# Altium schematic sheet LED-PCB_DIG1.SchDoc
size B; SheetNumber: 3; SheetTotal: 5
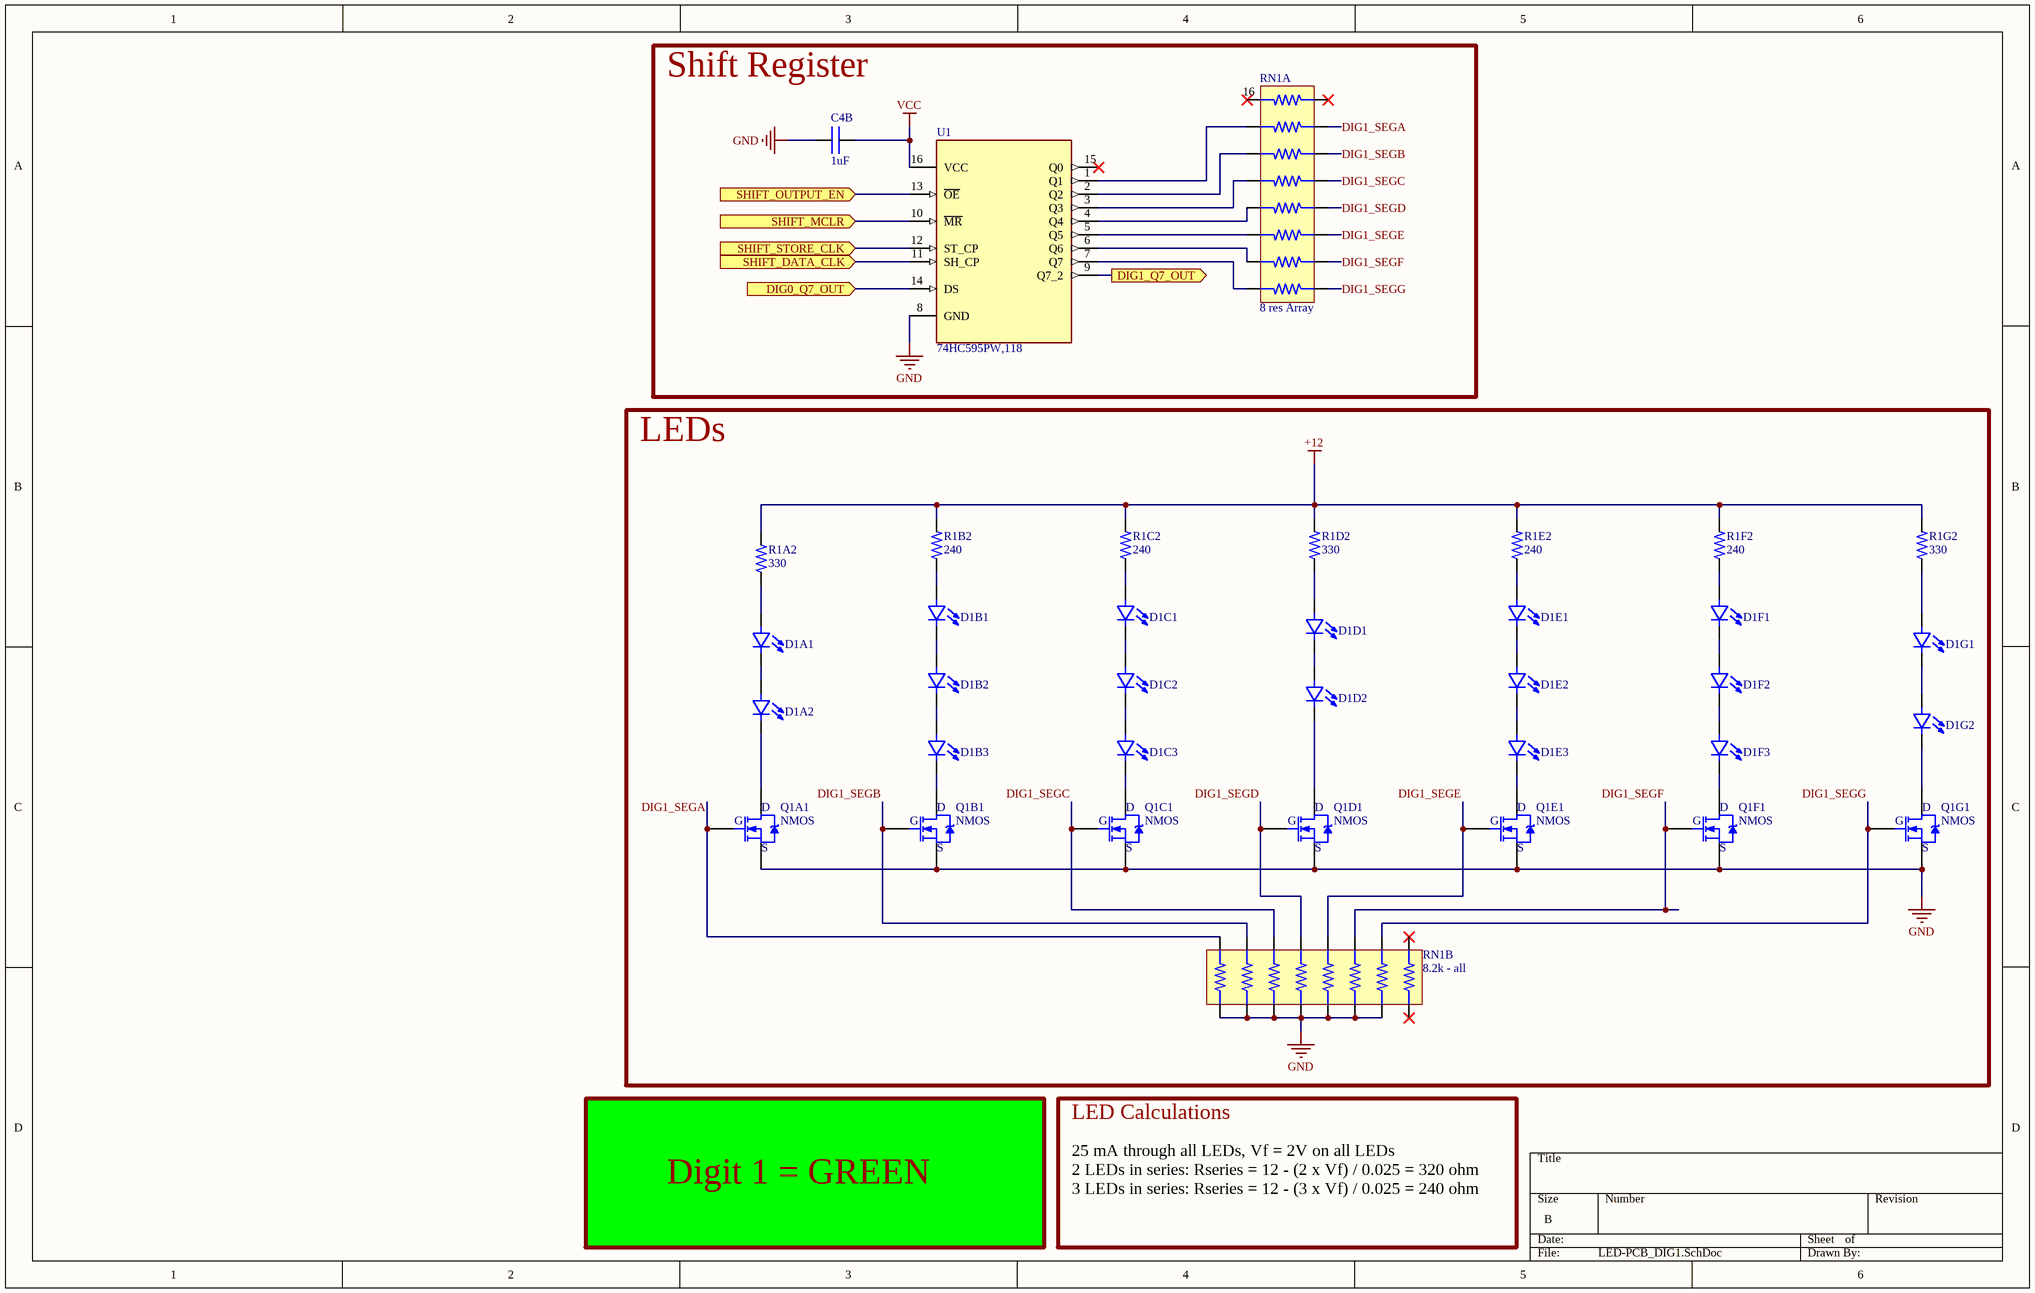
[diagram p0: LED-PCB_DIG1.SchDoc]

## Parts
C4B  value 1uF  [0402 CAP]  (hidden comment: CAP)
D1A1  LED - single  [LED - 0603]  (value not drawn)
D1A2  LED - single  [LED - 0603]  (value not drawn)
D1B1  LED - single  [LED - 0603]  (value not drawn)
D1B2  LED - single  [LED - 0603]  (value not drawn)
D1B3  LED - single  [LED - 0603]  (value not drawn)
D1C1  LED - single  [LED - 0603]  (value not drawn)
D1C2  LED - single  [LED - 0603]  (value not drawn)
D1C3  LED - single  [LED - 0603]  (value not drawn)
D1D1  LED - single  [LED - 0603]  (value not drawn)
D1D2  LED - single  [LED - 0603]  (value not drawn)
D1E1  LED - single  [LED - 0603]  (value not drawn)
D1E2  LED - single  [LED - 0603]  (value not drawn)
D1E3  LED - single  [LED - 0603]  (value not drawn)
D1F1  LED - single  [LED - 0603]  (value not drawn)
D1F2  LED - single  [LED - 0603]  (value not drawn)
D1F3  LED - single  [LED - 0603]  (value not drawn)
D1G1  LED - single  [LED - 0603]  (value not drawn)
D1G2  LED - single  [LED - 0603]  (value not drawn)
Q1A1  NMOS  [SOT-23]
Q1B1  NMOS  [SOT-23]
Q1C1  NMOS  [SOT-23]
Q1D1  NMOS  [SOT-23]
Q1E1  NMOS  [SOT-23]
Q1F1  NMOS  [SOT-23]
Q1G1  NMOS  [SOT-23]
R1A2  value 330  [0402 RES]  (hidden comment: RES)
R1B2  value 240  [0402 RES]  (hidden comment: RES)
R1C2  value 240  [0402 RES]  (hidden comment: RES)
R1D2  value 330  [0402 RES]  (hidden comment: RES)
R1E2  value 240  [0402 RES]  (hidden comment: RES)
R1F2  value 240  [0402 RES]  (hidden comment: RES)
R1G2  value 330  [0402 RES]  (hidden comment: RES)
RN1A  8 res Array  [EXB2HV331JV]
RN1B  8.2k - all  [MNR18ERAPJ822]
U1  74HC595PW,118  [16-TSSOP]

## Blocks framed on the sheet
Shift Register: C4B RN1A U1
LEDs: D1A1 D1A2 D1B1-D1B3 D1C1-D1C3 D1D1 D1D2 D1E1-D1E3 D1F1-D1F3 D1G1 D1G2 Q1A1 Q1B1 Q1C1 Q1D1 Q1E1 Q1F1 Q1G1 R1A2 R1B2 R1C2 R1D2 R1E2 R1F2 R1G2 RN1B

## Ports
DIG0_Q7_OUT (in, see LED-PCB_Master[1B], LED-PCB_DIG0[4A]), DIG1_Q7_OUT (out, see LED-PCB_Master[1B], LED-PCB_DIG2[3A]), SHIFT_DATA_CLK (in, see LED-PCB_Master[1B], LED-PCB_DIG0[3A], LED-PCB_DIG2[3A], LED-PCB_DIG3[2B]), SHIFT_MCLR (in, see LED-PCB_Master[1B], LED-PCB_DIG0[3A], LED-PCB_DIG2[3A], LED-PCB_DIG3[2B]), SHIFT_OUTPUT_EN (in, see LED-PCB_Master[1B], LED-PCB_DIG0[3A], LED-PCB_DIG2[3A], LED-PCB_DIG3[2B]), SHIFT_STORE_CLK (in, see LED-PCB_Master[1B], LED-PCB_DIG0[3A], LED-PCB_DIG2[3A], LED-PCB_DIG3[2B])

## Nets
+12: R1A2.2 R1B2.2 R1C2.2 R1D2.2 R1E2.2 R1F2.2 R1G2.2
GND: C4B.1 Q1A1.2(S) Q1B1.2(S) Q1C1.2(S) Q1D1.2(S) Q1E1.2(S) Q1F1.2(S) Q1G1.2(S) RN1B.1 RN1B.2 RN1B.3 RN1B.4 RN1B.5 RN1B.6 RN1B.7 U1.8(GND)
VCC: C4B.2 U1.16(VCC)
DIG0_Q7_OUT: U1.14(DS) ; port DIG0_Q7_OUT
DIG1_Q7_OUT: U1.9(Q7_2) ; port DIG1_Q7_OUT
DIG1_SEGA: Q1A1.1(G) RN1A.2 RN1B.16
DIG1_SEGB: Q1B1.1(G) RN1A.3 RN1B.15
DIG1_SEGC: Q1C1.1(G) RN1A.4 RN1B.14
DIG1_SEGD: Q1D1.1(G) RN1A.5 RN1B.13
DIG1_SEGE: Q1E1.1(G) RN1A.6 RN1B.12
DIG1_SEGF: Q1F1.1(G) RN1A.7 RN1B.11
DIG1_SEGG: Q1G1.1(G) RN1A.8 RN1B.10
SHIFT_DATA_CLK: U1.11(SH_CP) ; port SHIFT_DATA_CLK
SHIFT_MCLR: U1.10(~{MR}) ; port SHIFT_MCLR
SHIFT_OUTPUT_EN: U1.13(~{OE}) ; port SHIFT_OUTPUT_EN
SHIFT_STORE_CLK: U1.12(ST_CP) ; port SHIFT_STORE_CLK
NetD1A1_1: D1A1.1(A) R1A2.1
NetD1A1_2: D1A1.2(C) D1A2.1(A)
NetD1A2_2: D1A2.2(C) Q1A1.3(D)
NetD1B1_1: D1B1.1(A) R1B2.1
NetD1B1_2: D1B1.2(C) D1B2.1(A)
NetD1B2_2: D1B2.2(C) D1B3.1(A)
NetD1B3_2: D1B3.2(C) Q1B1.3(D)
NetD1C1_1: D1C1.1(A) R1C2.1
NetD1C1_2: D1C1.2(C) D1C2.1(A)
NetD1C2_2: D1C2.2(C) D1C3.1(A)
NetD1C3_2: D1C3.2(C) Q1C1.3(D)
NetD1D1_1: D1D1.1(A) R1D2.1
NetD1D1_2: D1D1.2(C) D1D2.1(A)
NetD1D2_2: D1D2.2(C) Q1D1.3(D)
NetD1E1_1: D1E1.1(A) R1E2.1
NetD1E1_2: D1E1.2(C) D1E2.1(A)
NetD1E2_2: D1E2.2(C) D1E3.1(A)
NetD1E3_2: D1E3.2(C) Q1E1.3(D)
NetD1F1_1: D1F1.1(A) R1F2.1
NetD1F1_2: D1F1.2(C) D1F2.1(A)
NetD1F2_2: D1F2.2(C) D1F3.1(A)
NetD1F3_2: D1F3.2(C) Q1F1.3(D)
NetD1G1_1: D1G1.1(A) R1G2.1
NetD1G1_2: D1G1.2(C) D1G2.1(A)
NetD1G2_2: D1G2.2(C) Q1G1.3(D)
NetRN1A_9: RN1A.9 U1.7(Q7)
NetRN1A_10: RN1A.10 U1.6(Q6)
NetRN1A_11: RN1A.11 U1.5(Q5)
NetRN1A_12: RN1A.12 U1.4(Q4)
NetRN1A_13: RN1A.13 U1.3(Q3)
NetRN1A_14: RN1A.14 U1.2(Q2)
NetRN1A_15: RN1A.15 U1.1(Q1)

Not connected (* = marked no-connect by the designer): RN1A 1* 16*; RN1B 8* 9*; U1 15(Q0)*

## Notes on the sheet
- LED Calculations
- Digit 1 = GREEN
- 25 mA through all LEDs, Vf = 2V on all LEDs
  2 LEDs in series: Rseries = 12 - (2 x Vf) / 0.025 = 320 ohm
  3 LEDs in series: Rseries = 12 - (3 x Vf) / 0.025 = 240 ohm

## Library data of the parts
C4B = CAP: Capaicitor; MFR PN: CL05A105KP5NNNC; MFR: Samsung Microelectronics
D1A1 D1A2 D1B1-D1B3 D1C1-D1C3 D1D1 D1D2 D1E1-D1E3 D1F1-D1F3 D1G1 D1G2 = LED - single: MFR PN: 150060RS75000; MFR: Wurth Elektronik; Color: Red
Q1A1 Q1B1 Q1C1 Q1D1 Q1E1 Q1F1 Q1G1 = NMOS: N-Channel MOSFET; MFR PN: DMN63D8L-7; MFR: Diodes Incorporated
R1A2 R1D2 R1G2 = RES: Resistor; MFR PN: RC0402JR-13330RL; MFR: YAGEO
R1B2 R1C2 R1E2 R1F2 = RES: Resistor; MFR PN: RC0402FR-07240RL; MFR: YAGEO
RN1A = 8 res Array: MFR PN: EXB-2HV331JV; MFR: Panasonic Microelectronics; Value: 330; Vendor: *; Vendor PN: *; ComponentLink1Description: New link; ComponentLink1URL: *; ComponentLink2Description: New link 1; ComponentLink2URL: *; Vendor Link: *
RN1B = MNR18ERAPJ822: 8.2k Ohm ±5% 62.5mW Power Per Element Isolated 8 Resistor Network/Array ±250ppm/°C 1606, Convex, Long Side Terminals; MFR: Rohm Semiconductor; MFR PN: MNR18ERAPJ822
U1 = 74HC595PW,118: Shift Shift Register 1 Element 8 Bit 16-TSSOP; MFR PN: 74HC595PW,118; Nexperia USA: *